# Altium schematic sheet Ethernet.SchDoc
size 420 x 297 mm; Address1: Address1; Address2: Address2; Address3: Address3; Address4: Address4; DocumentNumber: *Э3; SheetNumber: 9; SheetTotal: 11; DocumentType: Схема электрическая *
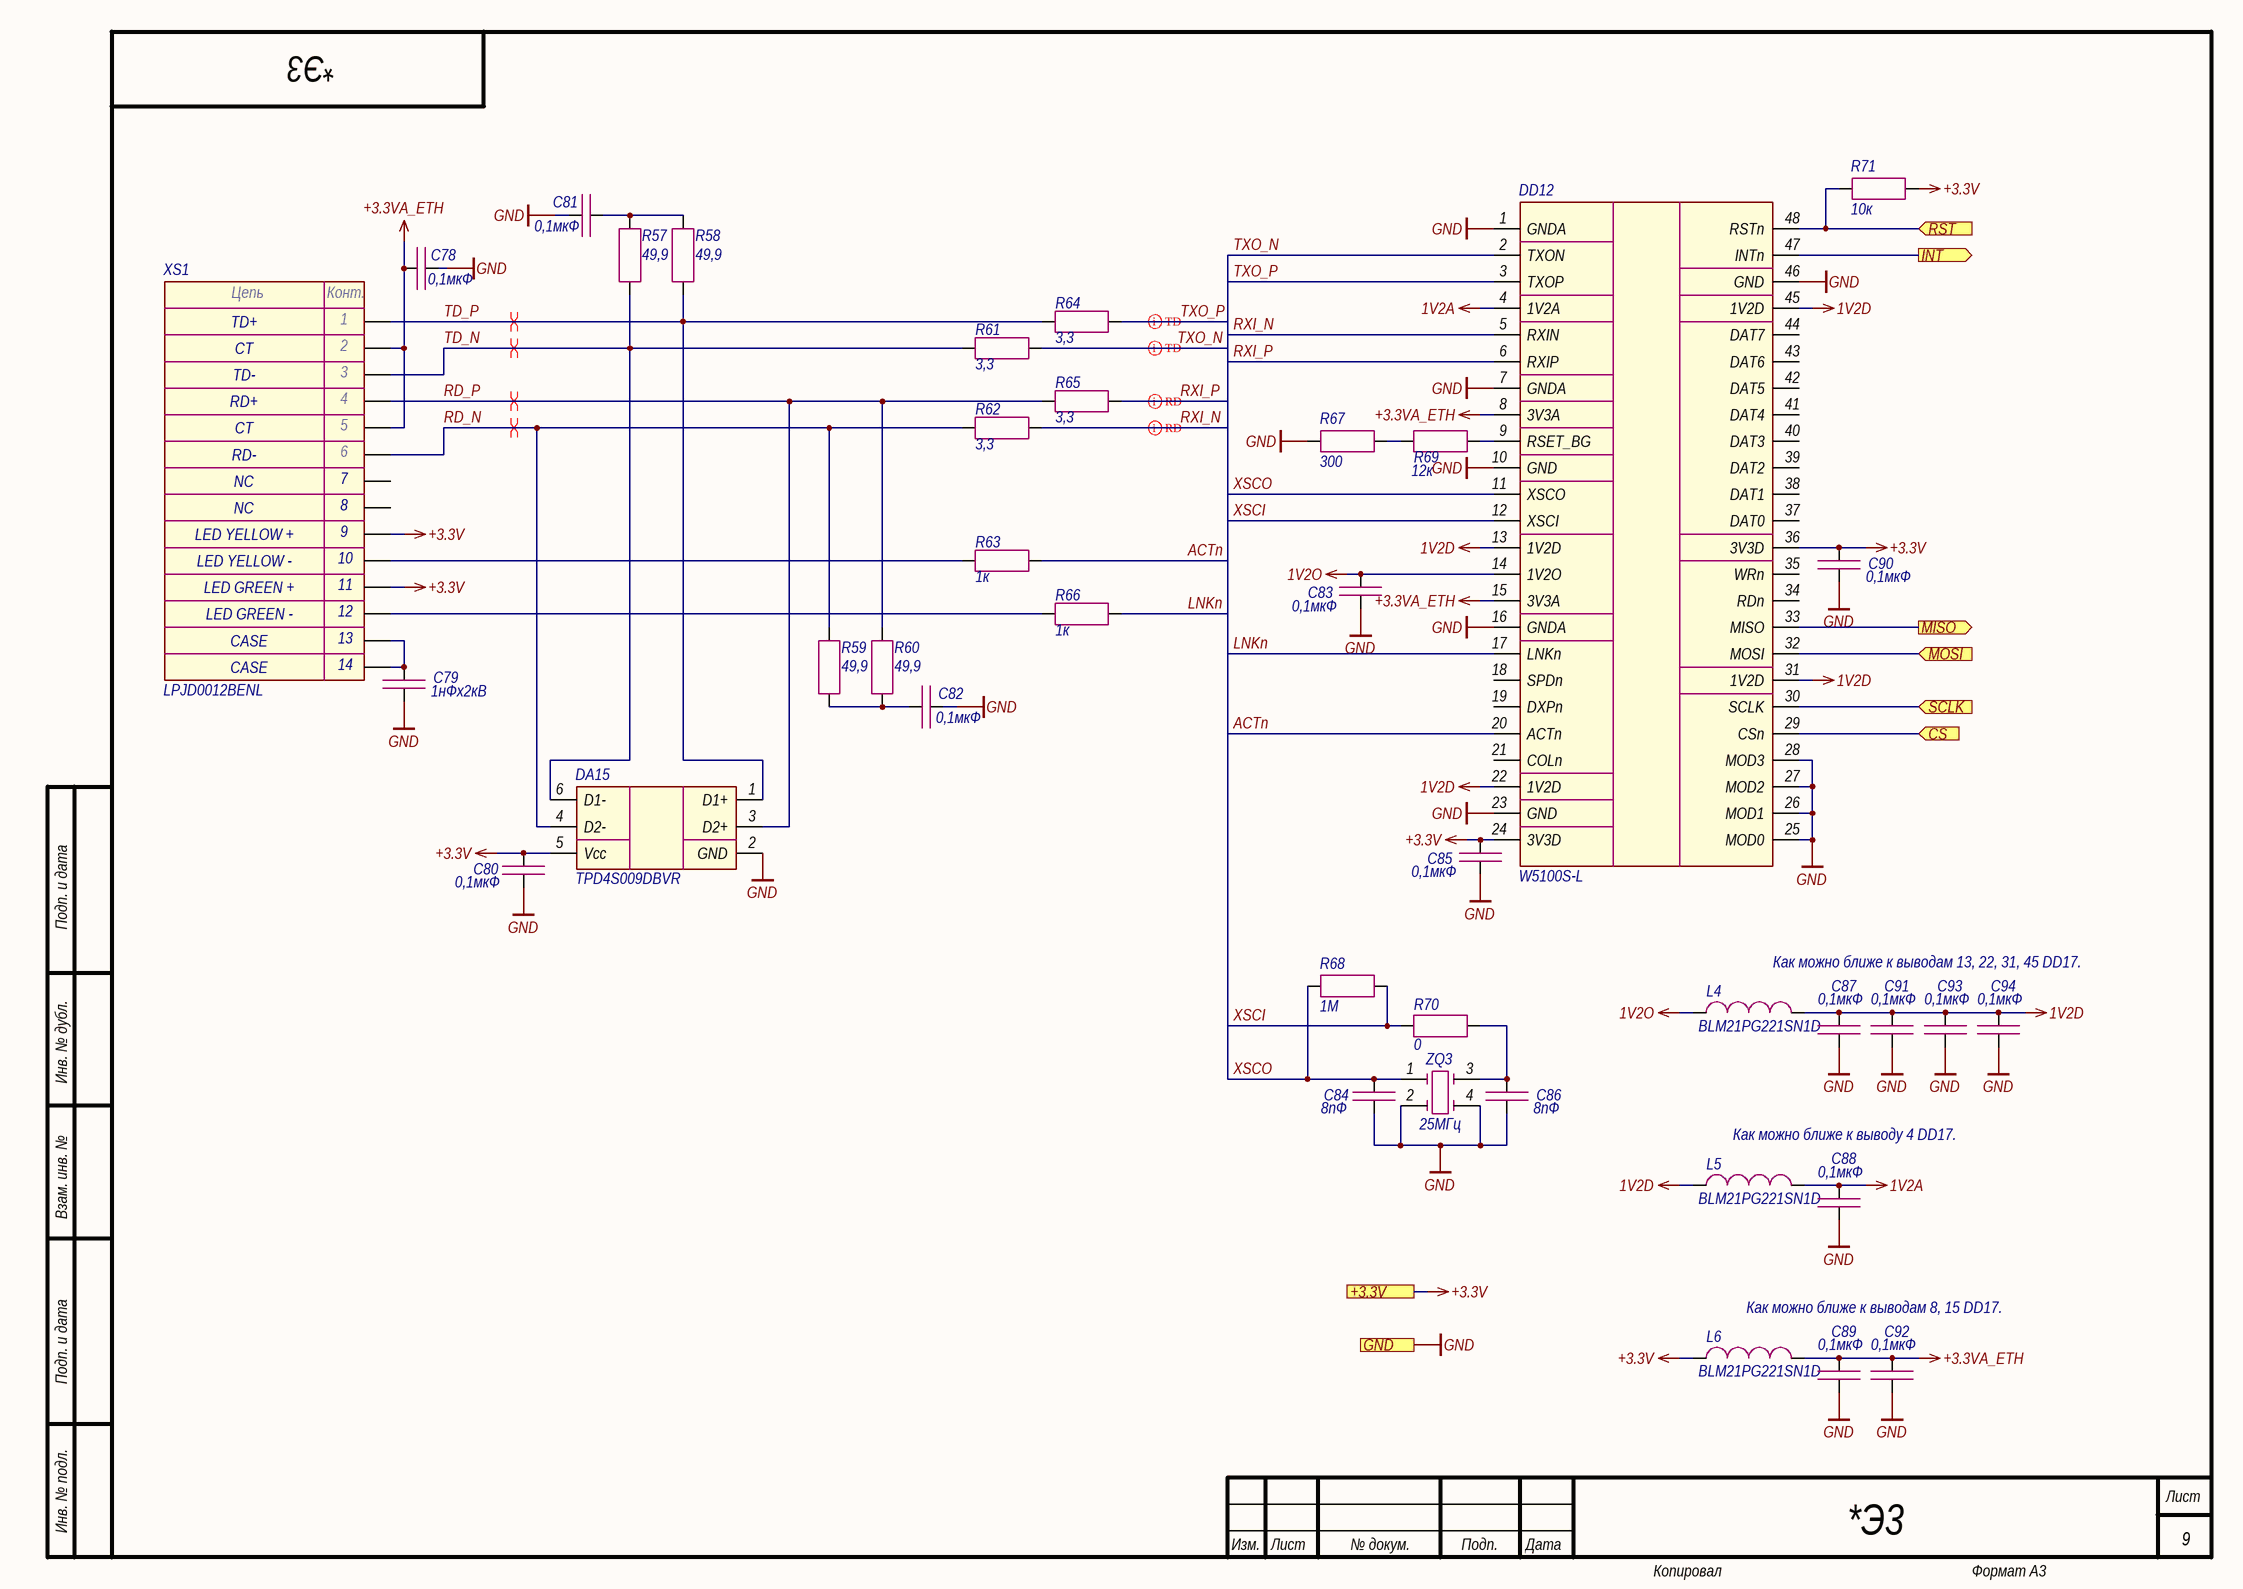
[diagram p0: Ethernet.SchDoc]

## Parts
C78  0,1мкФ  [CAP_0603]
C79  1нФх2кВ  [CAP_1206]
C80  0,1мкФ  [CAP_0603]
C81  0,1мкФ  [CAP_0603]
C82  0,1мкФ  [CAP_0603]
C83  0,1мкФ  [CAP_0603]
C84  8пФ  [CAP_0603]
C85  0,1мкФ  [CAP_0603]
C86  8пФ  [CAP_0603]
C87  0,1мкФ  [CAP_0603]
C88  0,1мкФ  [CAP_0603]
C89  0,1мкФ  [CAP_0603]
C90  0,1мкФ  [CAP_0603]
C91  0,1мкФ  [CAP_0603]
C92  0,1мкФ  [CAP_0603]
C93  0,1мкФ  [CAP_0603]
C94  0,1мкФ  [CAP_0603]
DA15  TPD4S009DBVR  [SOT-23-6]
DD12  W5100S-L  [LQFP-48]
L4  BLM21PG221SN1D  [IND_0805]
L5  BLM21PG221SN1D  [IND_0805]
L6  BLM21PG221SN1D  [IND_0805]
R57  49,9  [RES_0603]
R58  49,9  [RES_0603]
R59  49,9  [RES_0603]
R60  49,9  [RES_0603]
R61  3,3  [RES_0603]
R62  3,3  [RES_0603]
R63  1к  [RES_0603]
R64  3,3  [RES_0603]
R65  3,3  [RES_0603]
R66  1к  [RES_0603]
R67  300  [RES_0603]
R68  1М  [RES_0603]
R69  12к  [RES_0603]
R70  0  [RES_0603]
R71  10к  [RES_0603]
XS1  LPJD0012BENL  [LPJD0012BENL]
ZQ3  25МГц  [7M]

## Ports
+3.3V (see Main[3B], Fiber_interlock[2C], Flow_sensor[2C], Hardwiring[3D], LD_driver[1D], Power_supply[1D]), CS (in, see Main[2B]), GND (see Main[3B], Fiber_interlock[2C], Flow_sensor[2C], Guide_laser[1C], Hardwiring[3D], Indication[1C], LD_driver[1D], Power_supply[1D]), INT (out, see Main[3B]), MISO (out, see Main[2B]), MOSI (in, see Main[2B]), RST (in, see Main[3B]), SCLK (in, see Main[2B])

## Nets
1V2A: C88.1 DD12.4(1V2A) L5.2
1V2D: C87.1 C91.1 C93.1 C94.1 DD12.13(1V2D) DD12.22(1V2D) DD12.31(1V2D) DD12.45(1V2D) L4.2 L5.1
1V2O: C83.1 DD12.14(1V2O) L4.1
+3.3V: C80.1 C85.1 C90.1 DA15.5(Vcc) DD12.24(3V3D) DD12.36(3V3D) L6.1 R71.2 XS1.9 XS1.11 ; port +3.3V
+3.3VA_ETH: C78.1 C89.1 C92.1 DD12.8(3V3A) DD12.15(3V3A) L6.2 XS1.2 XS1.5
GND: C78.2 C79.2 C80.2 C81.2 C82.2 C83.2 C84.2 C85.2 C86.2 C87.2 C88.2 C89.2 C90.2 C91.2 C92.2 C93.2 C94.2 DA15.2(GND) DD12.1(GNDA) DD12.7(GNDA) DD12.10(GND) DD12.16(GNDA) DD12.23(GND) DD12.25(MOD0) DD12.26(MOD1) DD12.27(MOD2) DD12.28(MOD3) DD12.46(GND) R67.1 ZQ3.2 ZQ3.4 ; port GND
ACTn: DD12.20(ACTn) R63.2
CS: DD12.29(CSn) ; port CS
INT: DD12.47(INTn) ; port INT
LNKn: DD12.17(LNKn) R66.2
MISO: DD12.33(MISO) ; port MISO
MOSI: DD12.32(MOSI) ; port MOSI
RD_N: DA15.4(D2-) R59.1 R62.2 XS1.6
RD_P: DA15.3(D2+) R60.1 R65.2 XS1.4
RST: DD12.48(RSTn) R71.1 ; port RST
RXI_N: DD12.5(RXIN) R62.1
RXI_P: DD12.6(RXIP) R65.1
SCLK: DD12.30(SCLK) ; port SCLK
TD_N: DA15.6(D1-) R57.1 R61.2 XS1.3
TD_P: DA15.1(D1+) R58.1 R64.2 XS1.1
TXO_N: DD12.2(TXON) R61.1
TXO_P: DD12.3(TXOP) R64.1
XSCI: DD12.12(XSCI) R68.2 R70.1
XSCO: C84.1 DD12.11(XSCO) R68.1 ZQ3.1
NetC79_1: C79.1 XS1.13 XS1.14
NetC81_1: C81.1 R57.2 R58.2
NetC82_1: C82.1 R59.2 R60.2
NetC86_1: C86.1 R70.2 ZQ3.3
NetDD12_9: DD12.9(RSET_BG) R69.2
NetR63_1: R63.1 XS1.10
NetR66_1: R66.1 XS1.12
NetR67_2: R67.2 R69.1

Not connected (* = marked no-connect by the designer): DD12 18(SPDn) 19(DXPn) 21(COLn) 34(RDn) 35(WRn) 37(DAT0) 38(DAT1) 39(DAT2) 40(DAT3) 41(DAT4) 42(DAT5) 43(DAT6) 44(DAT7); XS1 7 8

## Layout directives
differential pair; differential pair class TD: TXO_N, TXO_P
differential pair; differential pair class RD: RXI_N, RXI_P
differential pair: RD_N, RD_P, TD_N, TD_P

## Notes on the sheet
- Как можно ближе к выводам 13, 22, 31, 45 DD17.
- Как можно ближе к выводу 4 DD17.
- Как можно ближе к выводам 8, 15 DD17.
- Подп. и дата
- Инв. № дубл.
- Взам. инв. №
- Инв. № подл.
- Изм.
- Лист
- № докум.
- Подп.
- Дата
- Копировал
- Формат А3
- (in symbol LPJD0012BENL) Цепь; Конт.; TD+; CT; TD-; RD+; RD-; NC; LED YELLOW +; LED YELLOW -; LED GREEN +; LED GREEN -; CASE

## Library data of the parts
C78 C80-C83 C85 C87-C94 = Capacitor: Manufacturer: Murata; Model: GRM188R71H104KA93D; Value: 0,1мкФ; Document: *
C79 = Capacitor: Manufacturer: Yageo; Model: CC1206KKX7RDBB102; Value: 1нФх2кВ; Document: *
C84 C86 = Capacitor: Manufacturer: Yageo; Model: CC0603CRNPO9BN8R0; Value: 8пФ; Document: *
DA15 = TPD4S009: Manufacturer: Texas Instruments; Model: TPD4S009DBVR; Document: *
DD12 = W5100S: Manufacturer: Wiznet; Model: W5100S-L; Document: *
L4-L6 = Inductor: Manufacturer: Murata; Value: *; Model: BLM21PG221SN1D; Document: *
R57-R60 = Resistor: Manufacturer: Yageo; Model: RC0603FR-0749R9L; Value: 49,9; Document: *
R61 R62 R64 R65 = Resistor: Manufacturer: Yageo; Model: RC0603FR-073R3L; Value: 3,3; Document: *
R63 R66 = Resistor: Manufacturer: Yageo; Model: RC0603FR-071KL; Value: 1к; Document: *
R67 = Resistor: Manufacturer: Yageo; Model: RC0603FR-07300RL; Value: 300; Document: *
R68 = Resistor: Manufacturer: Yageo; Model: RC0603FR-071ML; Value: 1М; Document: *
R69 = Resistor: Manufacturer: Yageo; Model: RC0603FR-0712KL; Value: 12к; Document: *
R70 = Resistor: Manufacturer: Yageo; Model: RC0603FR-070RL; Value: 0; Document: *
R71 = Resistor: Manufacturer: Yageo; Model: RC0603FR-0710KL; Value: 10к; Document: *
XS1 = LPJD0012BENL: Manufacturer: LINK-PP; Model: LPJD0012BENL; Document: *
ZQ3 = Quartz_Resonator_4-pin: Manufacturer: TXC; Model: 7M-25.000MAAJ-T; Value: 25МГц; Document: *